# EAGLE schematic stm32f4-discovery-breakout-v2 (EAGLE 7.1.0)
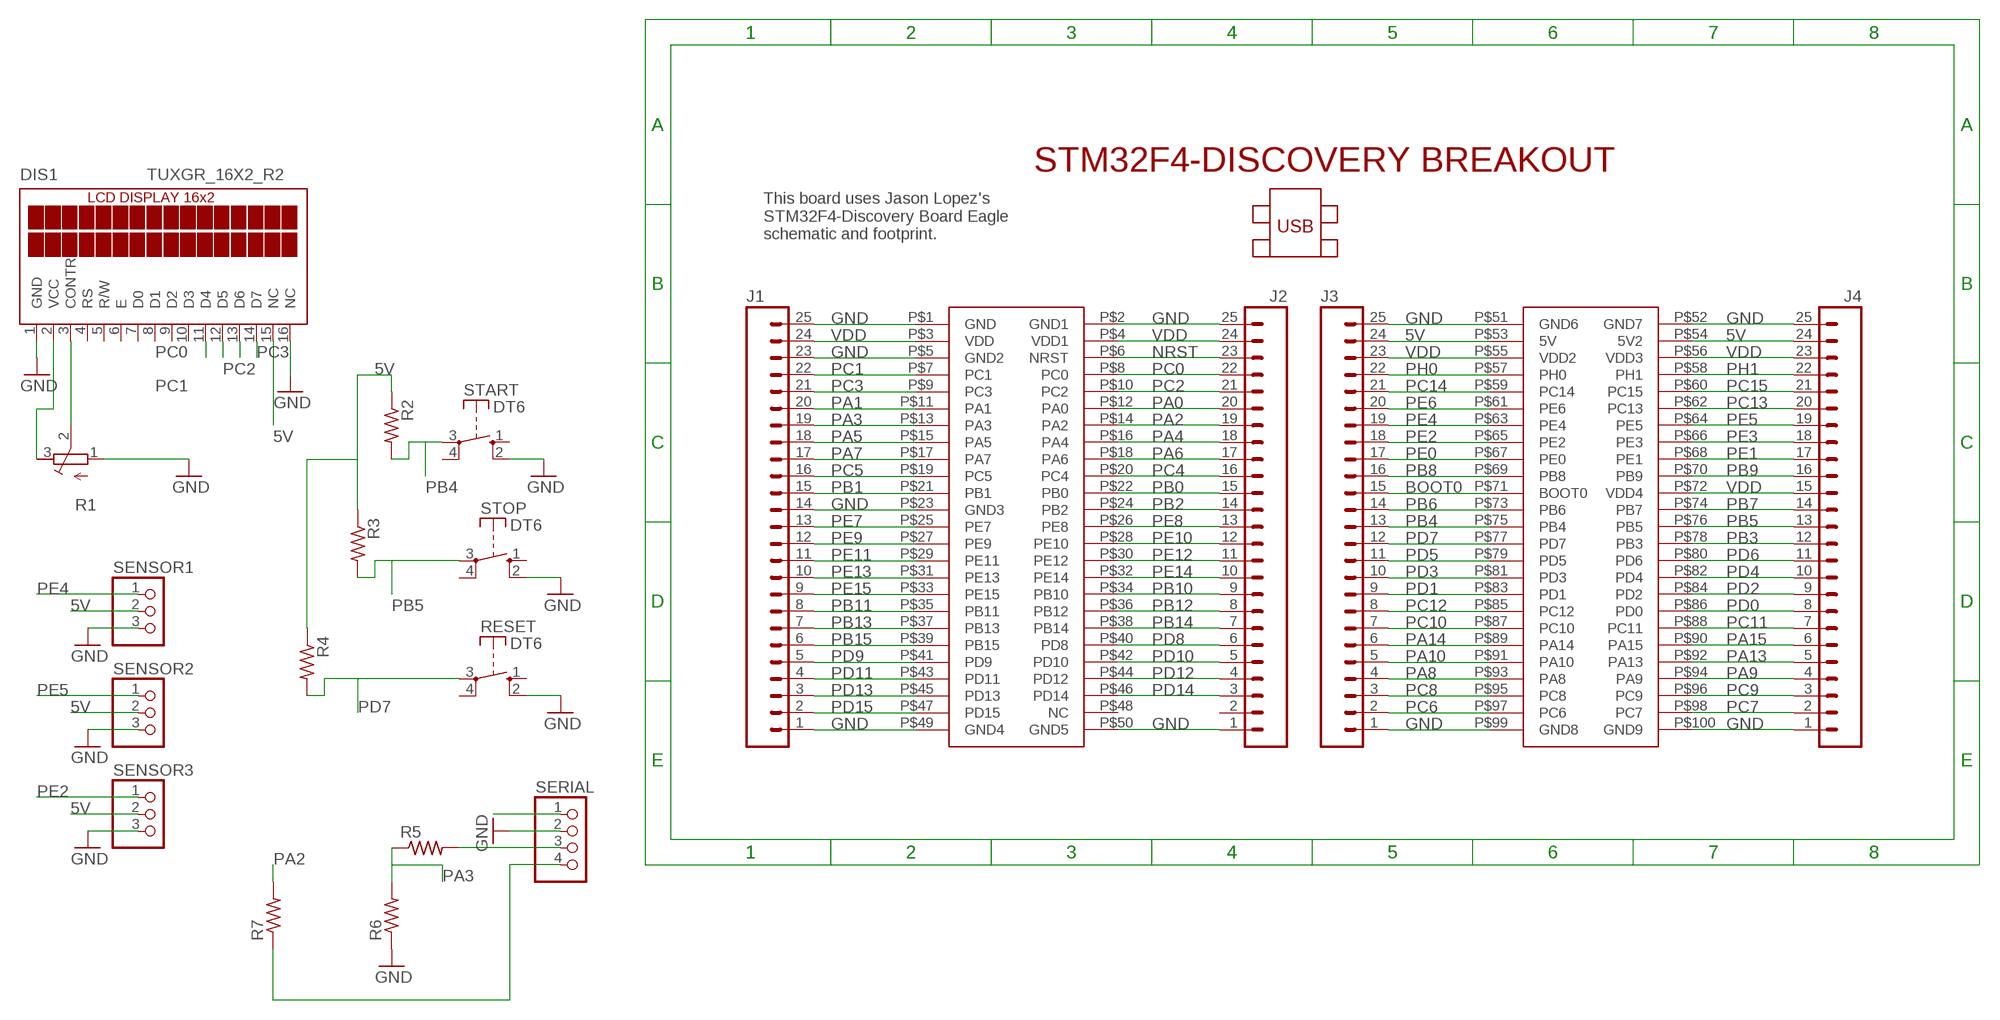
[diagram p0: schematic, sheet 1]

## Parts
DIS1  TUXGR_16X2_R2  [TUXGR_16X2_R2]
J1  M25LOCK_LONGPADS  [1X25_LOCK_LONGPADS]
J2  M25LOCK_LONGPADS  [1X25_LOCK_LONGPADS]
J3  M25LOCK_LONGPADS  [1X25_LOCK_LONGPADS]
J4  M25LOCK_LONGPADS  [1X25_LOCK_LONGPADS]
R1  R-TRIMM3339P  [RTRIM3339P]
R2  R-US_0207/10  [0207/10]
R3  R-US_0207/10  [0207/10]
R4  R-US_0207/10  [0207/10]
R5  R-US_0207/10  [0207/10]
R6  R-US_0207/10  [0207/10]
R7  R-US_0207/10  [0207/10]
RESET  DT6  [DT6]
SENSOR1  PINHD-1X3  [1X03]
SENSOR2  PINHD-1X3  [1X03]
SENSOR3  PINHD-1X3  [1X03]
SERIAL  PINHD-1X4  [1X04]
START  DT6  [DT6]
STOP  DT6  [DT6]
U$1  STM32F4-DISCOVERY  [STM32F4-DISCOVERY]

## Nets
5V: DIS1.15(NC) J3.24 J4.24 R2.1 R3.1 R4.1 SENSOR1.2 SENSOR2.2 SENSOR3.2 SERIAL.1 U$1.P$53(5V) U$1.P$54(5V2)
BOOT0: J3.15 U$1.P$71(BOOT0)
GND: DIS1.1(GND) DIS1.16(NC) J1.1 J1.14 J1.23 J1.25 J2.1 J2.25 J3.1 J3.25 J4.1 J4.25 R1.1(E) R6.1 RESET.2(S) SENSOR1.3 SENSOR2.3 SENSOR3.3 SERIAL.2 START.2(S) STOP.2(S) U$1.P$1(GND) U$1.P$2(GND1) U$1.P$5(GND2) U$1.P$23(GND3) U$1.P$49(GND4) U$1.P$50(GND5) U$1.P$51(GND6) U$1.P$52(GND7) U$1.P$99(GND8) U$1.P$100(GND9)
N$1: DIS1.2(VCC) R1.3(A)
N$2: DIS1.3(CONTR) R1.2(S)
N$5: R5.2 SERIAL.3
N$7: R7.1 SERIAL.4
NRST: J2.23 U$1.P$6(NRST)
PA0: J2.20 U$1.P$12(PA0)
PA1: J1.20 U$1.P$11(PA1)
PA2: J2.19 R7.2 U$1.P$14(PA2)
PA3: J1.19 R5.1 R6.2 U$1.P$13(PA3)
PA4: J2.18 U$1.P$16(PA4)
PA5: J1.18 U$1.P$15(PA5)
PA6: J2.17 U$1.P$18(PA6)
PA7: J1.17 U$1.P$17(PA7)
PA8: J3.4 U$1.P$93(PA8)
PA9: J4.4 U$1.P$94(PA9)
PA10: J3.5 U$1.P$91(PA10)
PA13: J4.5 U$1.P$92(PA13)
PA14: J3.6 U$1.P$89(PA14)
PA15: J4.6 U$1.P$90(PA15)
PB0: J2.15 U$1.P$22(PB0)
PB1: J1.15 U$1.P$21(PB1)
PB2: J2.14 U$1.P$24(PB2)
PB3: J4.12 U$1.P$78(PB3)
PB4: J3.13 R2.2 START.3(P) U$1.P$75(PB4)
PB5: J4.13 R3.2 STOP.3(P) U$1.P$76(PB5)
PB6: J3.14 U$1.P$73(PB6)
PB7: J4.14 U$1.P$74(PB7)
PB8: J3.16 U$1.P$69(PB8)
PB9: J4.16 U$1.P$70(PB9)
PB10: J2.9 U$1.P$34(PB10)
PB11: J1.8 U$1.P$35(PB11)
PB12: J2.8 U$1.P$36(PB12)
PB13: J1.7 U$1.P$37(PB13)
PB14: J2.7 U$1.P$38(PB14)
PB15: J1.6 U$1.P$39(PB15)
PC0: DIS1.11(D4) J2.22 U$1.P$8(PC0)
PC1: DIS1.12(D5) J1.22 U$1.P$7(PC1)
PC2: DIS1.13(D6) J2.21 U$1.P$10(PC2)
PC3: DIS1.14(D7) J1.21 U$1.P$9(PC3)
PC4: J2.16 U$1.P$20(PC4)
PC5: J1.16 U$1.P$19(PC5)
PC6: J3.2 U$1.P$97(PC6)
PC7: J4.2 U$1.P$98(PC7)
PC8: J3.3 U$1.P$95(PC8)
PC9: J4.3 U$1.P$96(PC9)
PC10: J3.7 U$1.P$87(PC10)
PC11: J4.7 U$1.P$88(PC11)
PC12: J3.8 U$1.P$85(PC12)
PC13: J4.20 U$1.P$62(PC13)
PC14: J3.21 U$1.P$59(PC14)
PC15: J4.21 U$1.P$60(PC15)
PD0: J4.8 U$1.P$86(PD0)
PD1: J3.9 U$1.P$83(PD1)
PD2: J4.9 U$1.P$84(PD2)
PD3: J3.10 U$1.P$81(PD3)
PD4: J4.10 U$1.P$82(PD4)
PD5: J3.11 U$1.P$79(PD5)
PD6: J4.11 U$1.P$80(PD6)
PD7: J3.12 R4.2 RESET.3(P) U$1.P$77(PD7)
PD8: J2.6 U$1.P$40(PD8)
PD9: J1.5 U$1.P$41(PD9)
PD10: J2.5 U$1.P$42(PD10)
PD11: J1.4 U$1.P$43(PD11)
PD12: J2.4 U$1.P$44(PD12)
PD13: J1.3 U$1.P$45(PD13)
PD14: J2.3 U$1.P$46(PD14)
PD15: J1.2 U$1.P$47(PD15)
PE0: J3.17 U$1.P$67(PE0)
PE1: J4.17 U$1.P$68(PE1)
PE2: J3.18 SENSOR3.1 U$1.P$65(PE2)
PE3: J4.18 U$1.P$66(PE3)
PE4: J3.19 SENSOR1.1 U$1.P$63(PE4)
PE5: J4.19 SENSOR2.1 U$1.P$64(PE5)
PE6: J3.20 U$1.P$61(PE6)
PE7: J1.13 U$1.P$25(PE7)
PE8: J2.13 U$1.P$26(PE8)
PE9: J1.12 U$1.P$27(PE9)
PE10: J2.12 U$1.P$28(PE10)
PE11: J1.11 U$1.P$29(PE11)
PE12: J2.11 U$1.P$30(PE12)
PE13: J1.10 U$1.P$31(PE13)
PE14: J2.10 U$1.P$32(PE14)
PE15: J1.9 U$1.P$33(PE15)
PH0: J3.22 U$1.P$57(PH0)
PH1: J4.22 U$1.P$58(PH1)
VDD: J1.24 J2.24 J3.23 J4.15 J4.23 U$1.P$3(VDD) U$1.P$4(VDD1) U$1.P$55(VDD2) U$1.P$56(VDD3) U$1.P$72(VDD4)
Unconnected: DIS1.4(RS) DIS1.5(R/W) DIS1.6(E) DIS1.7(D0) DIS1.8(D1) DIS1.9(D2) DIS1.10(D3) J2.2 RESET.1(S) RESET.4(P) START.1(S) START.4(P) STOP.1(S) STOP.4(P) U$1.P$48(NC)

## Notes on the sheet
- This board uses Jason Lopez's
  STM32F4-Discovery Board Eagle 
  schematic and footprint.

## Library data of the parts
DIS1 = display-lcd:TUXGR_16X2_R2: Tuxgraphics LCD display 16x2 characters reflective, without background light Source: tuxgr_12x2_r2.pdf; OC_FARNELL: unknown; OC_NEWARK: unknown
J1-J4 = SparkFun-Connectors:M25: 1x25 .1" header
R1 = resistor:R-TRIMM: Trimm resistor
R2-R7 = rcl:R-US_: RESISTOR, American symbol
RESET START STOP = switch-misc:DT: ITT SWITCH
SENSOR1-SENSOR3 = pinhead:PINHD-1X3: PIN HEADER
SERIAL = pinhead:PINHD-1X4: PIN HEADER
U$1 = STM32F4-DISCOVERY:STM32F4-DISCOVERY